# EAGLE design main (EAGLE 9.0.0)
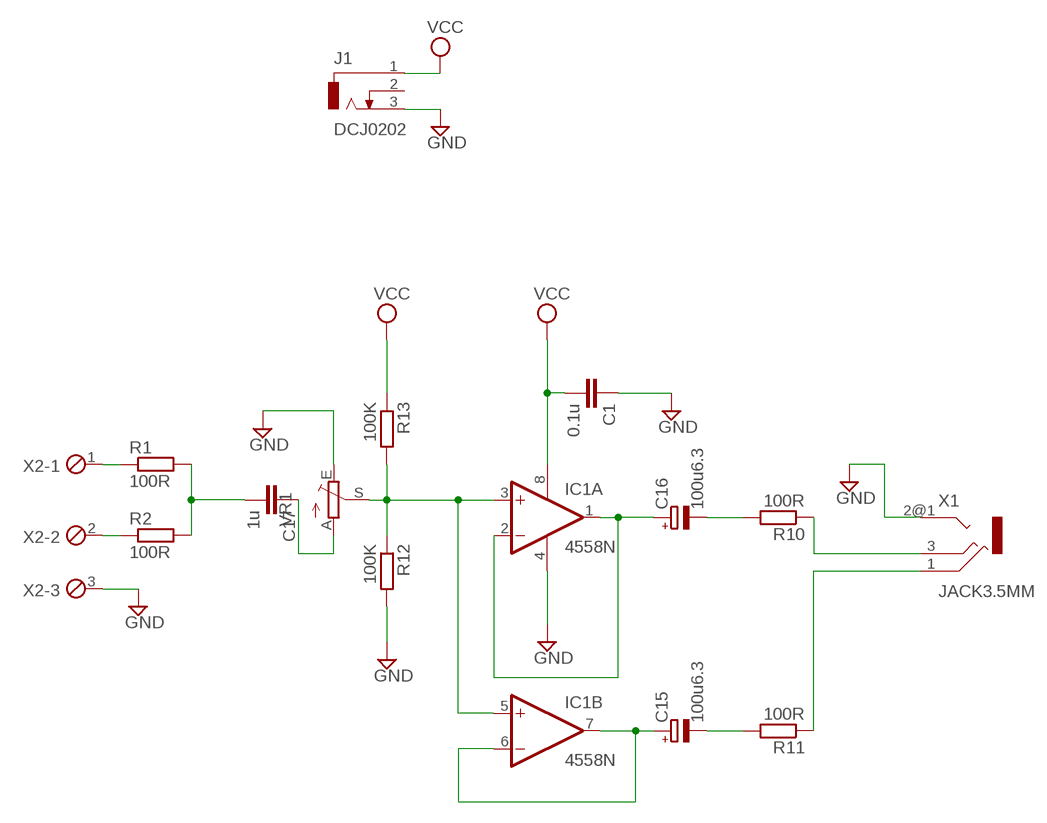
[diagram p0: schematic, sheet 1]

## Parts
C1  0.1u  C-EU050-024X044  [C050-024X044]
C15  100u6.3  CPOL-EUTAP5-45  [TAP5-45]
C16  100u6.3  CPOL-EUTAP5-45  [TAP5-45]
C17  1u  C-EU050-024X044  [C050-024X044]
IC1  4558N  [DIP08]
J1  DCJ0202  [DCJ0202]
R1  100R  RESISTOR0207/12  [0207(1/4W)]
R2  100R  RESISTOR0207/12  [0207(1/4W)]
R10  100R  RESISTOR0207/12  [0207(1/4W)]
R11  100R  RESISTOR0207/12  [0207(1/4W)]
R12  100K  RESISTOR0207/12  [0207(1/4W)]
R13  100K  RESISTOR0207/12  [0207(1/4W)]
VR1  KIT-TRIMPOTPOT_ST  [POT-ST]
X1  JACK3.5MM  [MJ-8435]
X2  MPT3  [3POL254]

## Nets
GND: C1.1 IC1.4(P:V-) J1.3 R12.2 VR1.E X1.2@1 X2.3
N$1: R10.1 X1.3
N$2: R11.1 X1.1
N$3: R2.1 X2.2
N$4: R1.1 X2.1
N$5: C17.2 R1.2 R2.2
N$6: C17.1 VR1.A
N$23: IC1.3(A:+IN) IC1.5(B:+IN) R12.1 R13.2 VR1.S
N$24: C16.+ IC1.1(A:OUT) IC1.2(A:-IN)
N$25: C16.- R10.2
N$26: C15.+ IC1.6(B:-IN) IC1.7(B:OUT)
N$27: C15.- R11.2
VCC: C1.2 IC1.8(P:V+) J1.1 R13.1
Unconnected: J1.2 X1.2@2

## Library data of the parts
C1 C17 = Capasitor:C-EU: CAPACITOR, European symbol
C15 C16 = Capasitor:CPOL-EU: POLARIZED CAPACITOR, European symbol
IC1 = OPAMP:*4558: NJM4558M ・動作電圧：±４～±１８Ｖ ・高利得：１００ｄＢ ｔｙｐ． ・高入力抵抗：５ＭΩ ｔｙｐ． ・バイポーラ構造 ・パッケージ：ＳＳＯＰ８ピン Source: DataSheet <http://akizukidenshi.com/download/ds/jrc/NJM4558.pdf>
J1 = jack:DCJ0202: DC POWER JACK Source: DCJ0202.pdf
R1 R2 R10-R13 = Resistor:RESISTOR: RESISTOR, European symbol
VR1 = Kit:KIT-TRIMPOT
X1 = jack:JACK3.5MM: 3.5 mm Stereo Audio Jack MJ-8435 Source: DataSheet <http://akizukidenshi.com/download/ds/marushin/mj8435.pdf>
X2 = con-phoenix-254:MPT3: PHOENIX CONNECTOR; OC_FARNELL: unknown; OC_NEWARK: unknown

## Board
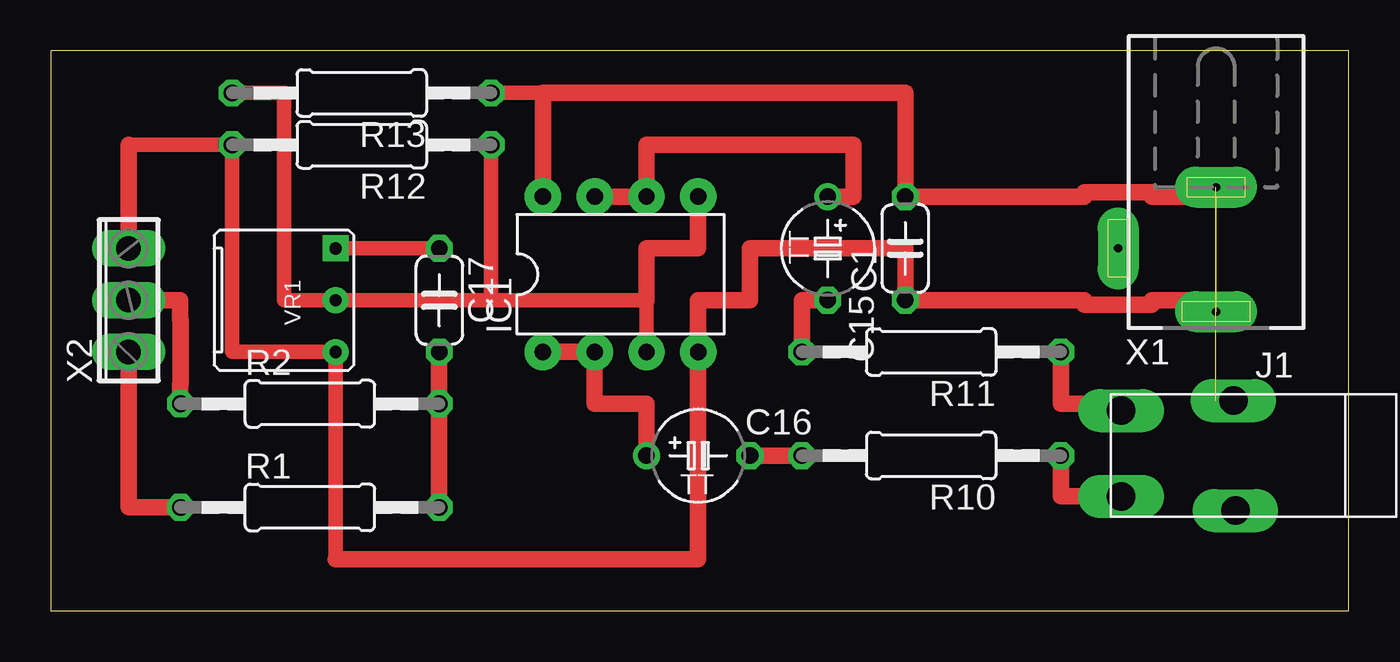
[diagram p1: board, top side]

Size 63.65 x 27.46 mm. Coordinates in mm from the lower left corner, seen from the top.
Outline: 0,0 63.65,0 63.65,27.46 0,27.46 0,0
Copper layers (1*16): Top 0.035mm / dielectric 1.5mm / Bottom 0.035mm
Design rules "default": minimum track width 6mil, minimum drill 0.35mm, track to track 6mil, track to pad 6mil, pad to pad 6mil, via to via 6mil, smd to smd 6mil, copper to edge 40mil, drill to drill 6mil, minimum pad ring 10mil, minimum via ring 8mil, stop-mask expansion 4mil, vias tented up to drill 0mil, thermal gap 10mil

### Footprints (pad centres in the part's own frame; a part is rotated, then mirrored left to right if it is on the bottom)
C050-024X044 = drill 0.813 octagon: 1 -2.54,0; 2 2.54,0
TAP5-45 = drill 0.813: + -2.54,0 | drill 0.813 octagon: - 2.54,0
DIP08 = drill 0.8 pad 1.778: 1 -3.81,3.81; 2 -3.81,1.27; 3 -3.81,-1.27; 4 -3.81,-3.81; 5 3.81,-3.81; 6 3.81,-1.27; 7 3.81,1.27; 8 3.81,3.81
DCJ0202 = drill 0.4 pad 2 long: 1 0,3.1; 2 4.8,0; 3 0,-3
0207(1/4W) = drill 0.813 octagon: 1 -6.35,0; 2 6.35,0
POT-ST = drill 0.6 pad 1.27 square: A -2.54,2.54 | drill 0.6 pad 1.27: E 2.54,2.54; S 0,2.54
MJ-8435 = drill 1.4 long: 1 -2.2,-11; 2@1 -2.7,-5.5; 2@2 2.7,-5.4; 3 2,-11
3POL254 = drill 1.2 long: 1 -2.54,0; 2 0,0; 3 2.54,0

### Placement (x,y rotation side)
C1  41.91,17.78 90 top
C15  38.1,17.78 270 top
C16  31.75,7.62 0 top
C17  19.05,15.24 270 top
IC1  27.94,16.51 90 top
J1  57.15,17.78 180 top
R1  12.7,5.08 0 top
R2  12.7,10.16 0 top
R10  43.18,7.62 180 top
R11  43.18,12.7 180 top
R12  15.24,22.86 180 top
R13  15.24,25.4 180 top
VR1  11.43,15.24 270 top
X1  63.5,7.62 270 top
X2  3.81,15.24 90 top

### Tracks (layer width: path | path; a pad name or v marks a point on that pad's centre or on a via)
GND  (2 unrouted)
  Top 0.7: 3.81,22.86 R12.2 8.89,12.7 VR1.E 13.97,2.54
  Top 0.813: 3.81,22.86 X2.3 | 13.97,2.54 31.75,2.54 IC1.4 31.75,15.24 34.29,15.24 34.29,17.78 41.91,17.78 C1.1 50.69,15.24 50.69,15.02 54.01,15.02 54.01,15.24 57.15,15.24 | X1.2@1 57.15,10.32
N$1
  Top 0.813: R10.1 49.53,5.62 X1.3
N$2
  Top 0.813: R11.1 49.53,10.16 52.5,10.16 X1.1
N$3
  Top 0.813: R2.1 6.35,11.14 6.37,11.14 6.37,14.26 6.35,14.26 6.35,15.24 X2.2
N$4
  Top 0.813: X2.1 3.81,5.08 R1.1
N$5
  Top 0.813: R1.2 19.05,7.62 R2.2 C17.2
N$6
  Top 0.7: VR1.A C17.1
N$23
  Top 0.7: 21.59,15.24 VR1.S 11.43,15.24 11.43,25.4 R13.2 | 21.59,15.24 R12.1 | 21.59,15.24 29.21,15.24 IC1.3
  Top 0.813: IC1.5 31.75,17.78 29.21,17.78 29.21,15.24
N$24
  Top 0.813: C16.+ 29.21,10.16 26.67,10.16 IC1.2 IC1.1
N$25
  Top 0.813: R10.2 C16.-
N$26
  Top 0.813: C15.+ 39.37,20.32 39.37,22.86 29.21,22.86 IC1.6 IC1.7
N$27
  Top 0.813: R11.2 36.83,15.24 C15.-
VCC  (1 unrouted)
  Top 0.7: R13.1 24.13,25.4
  Top 0.813: IC1.8 24.13,25.4 41.91,25.4 C1.2 50.69,20.32 50.69,20.54 54.01,20.54 54.01,20.32 57.15,20.32